# EAGLE design Word Clock (EAGLE 7.1.0)
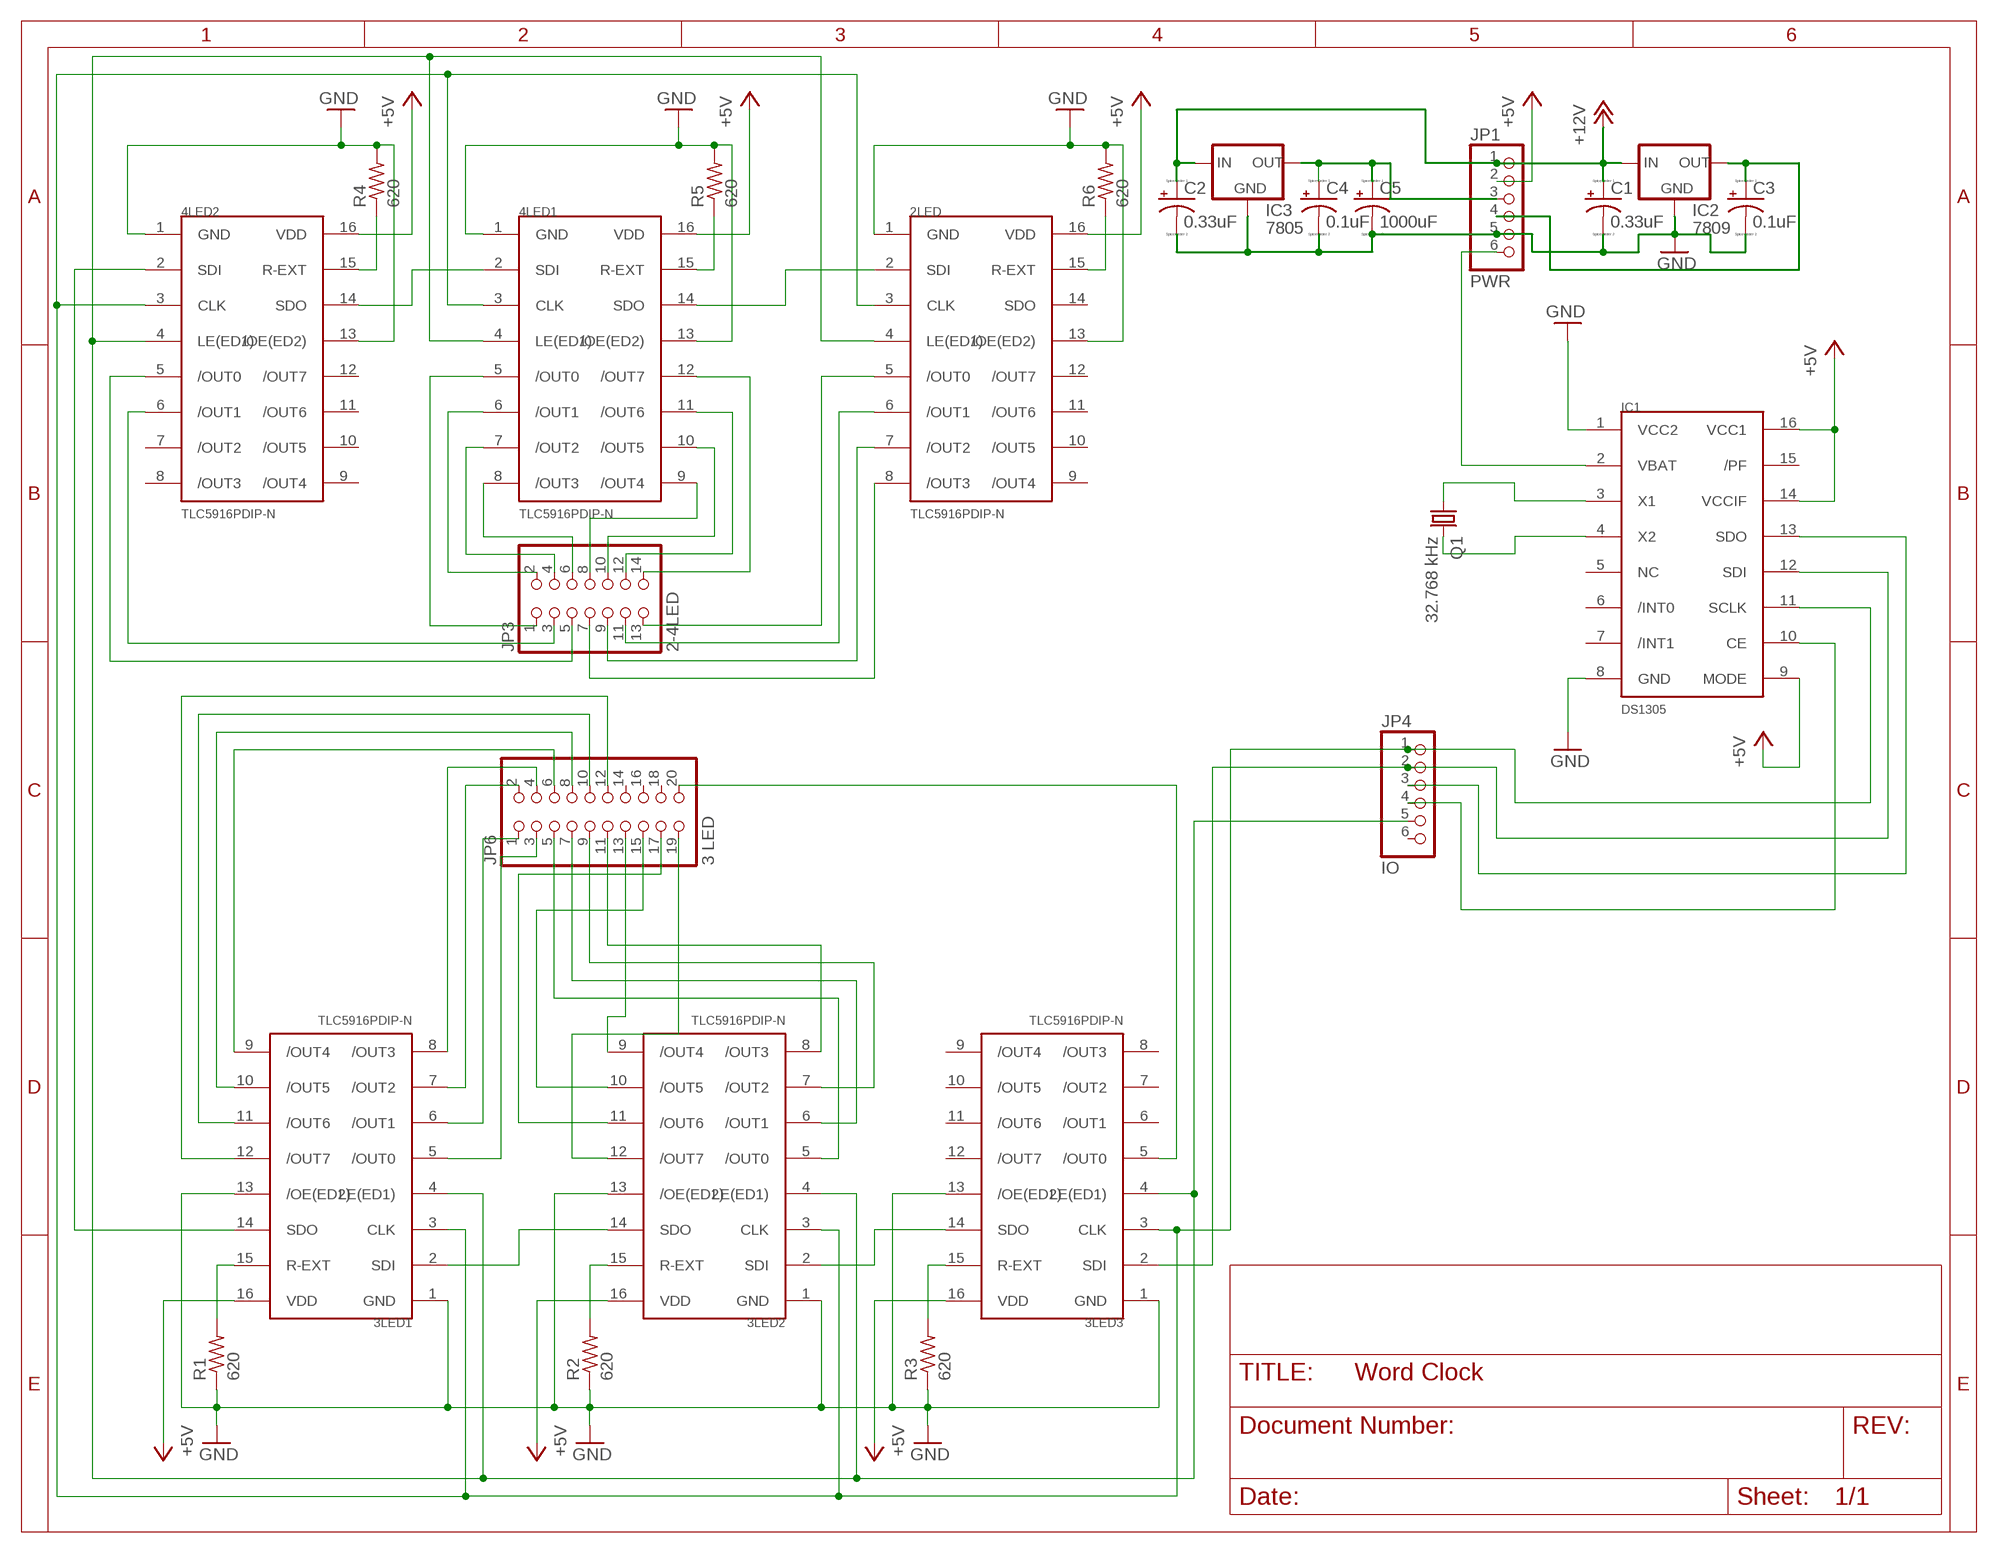
[diagram p0: schematic, sheet 1]

## Parts
2LED  TLC5916PDIP-N  [DIL16]
3LED1  TLC5916PDIP-N  [DIL16]
3LED2  TLC5916PDIP-N  [DIL16]
3LED3  TLC5916PDIP-N  [DIL16]
4LED1  TLC5916PDIP-N  [DIL16]
4LED2  TLC5916PDIP-N  [DIL16]
C1  0.33uF  CPOL-USE2-4  [E2-4]
C2  0.33uF  CPOL-USE2-4  [E2-4]
C3  0.1uF  CPOL-USE2-4  [E2-4]
C4  0.1uF  CPOL-USE2-4  [E2-4]
C5  1000uF  CPOL-USE3.5-8  [E3,5-8]
IC1  DS1305  [DIL16]
IC2  7809  78XXL  [78XXL]
IC3  7805  78XXL  [78XXL]
JP1  PWR  PINHD-1X6  [1X06]
JP3  2-4LED  PINHD-2X7  [2X07]
JP4  IO  PINHD-1X6  [1X06]
JP6  3 LED  PINHD-2X10  [2X10]
Q1  32.768 kHz  CRYSTALTC26V  [TC26V]
R1  620  R-US_V235/17  [V235/17]
R2  620  R-US_V235/17  [V235/17]
R3  620  R-US_V235/17  [V235/17]
R4  620  R-US_V235/17  [V235/17]
R5  620  R-US_V235/17  [V235/17]
R6  620  R-US_V235/17  [V235/17]

## Nets
+5V: 2LED.16(VDD) 3LED1.16(VDD) 3LED2.16(VDD) 3LED3.16(VDD) 4LED1.16(VDD) 4LED2.16(VDD) IC1.9(MODE) IC1.14(VCCIF) IC1.16(VCC1) JP1.2
+12V: C1.+ C2.+ IC2.IN IC3.IN JP1.1
GND: 2LED.1(GND) 2LED.13(/OE(ED2)) 3LED1.1(GND) 3LED1.13(/OE(ED2)) 3LED2.1(GND) 3LED2.13(/OE(ED2)) 3LED3.1(GND) 3LED3.13(/OE(ED2)) 4LED1.1(GND) 4LED1.13(/OE(ED2)) 4LED2.1(GND) 4LED2.13(/OE(ED2)) C1.- C2.- C3.- C4.- C5.- IC1.1(VCC2) IC1.8(GND) IC2.GND IC3.GND JP1.5 R1.1 R2.1 R3.1 R4.2 R5.2 R6.2
MISO: IC1.13(SDO) JP4.3
MOSI: 3LED3.2(SDI) IC1.12(SDI) JP4.2
N$1: IC1.3(X1) Q1.1
N$2: IC1.4(X2) Q1.2
N$3: 2LED.5(/OUT0) JP3.13
N$4: 2LED.6(/OUT1) JP3.11
N$5: IC1.2(VBAT) JP1.6
N$6: 2LED.7(/OUT2) JP3.9
N$7: C4.+ C5.+ IC3.OUT JP1.3
N$8: C3.+ IC2.OUT JP1.4
N$9: 2LED.8(/OUT3) JP3.7
N$10: 4LED1.12(/OUT7) JP3.14
N$11: 4LED1.11(/OUT6) JP3.12
N$12: 4LED1.10(/OUT5) JP3.10
N$13: 4LED1.9(/OUT4) JP3.8
N$14: 4LED1.8(/OUT3) JP3.6
N$15: 4LED1.7(/OUT2) JP3.4
N$16: 4LED1.6(/OUT1) JP3.2
N$17: 4LED1.5(/OUT0) JP3.1
N$18: 4LED2.6(/OUT1) JP3.3
N$19: 4LED2.5(/OUT0) JP3.5
N$20: 2LED.2(SDI) 4LED1.14(SDO)
N$21: 4LED1.2(SDI) 4LED2.14(SDO)
N$22: 3LED1.12(/OUT7) JP6.12
N$23: 3LED1.7(/OUT2) JP6.2
N$24: 3LED1.8(/OUT3) JP6.4
N$25: 3LED1.9(/OUT4) JP6.6
N$26: 4LED2.15(R-EXT) R4.1
N$27: 4LED1.15(R-EXT) R5.1
N$28: 2LED.15(R-EXT) R6.1
N$29: 3LED1.10(/OUT5) JP6.8
N$30: 3LED1.11(/OUT6) JP6.10
N$31: 3LED2.5(/OUT0) JP6.5
N$32: 3LED3.5(/OUT0) JP6.20
N$33: 3LED2.6(/OUT1) JP6.7
N$34: 3LED2.7(/OUT2) JP6.9
N$35: 2LED.4(LE(ED1)) 3LED1.4(LE(ED1)) 3LED2.4(LE(ED1)) 3LED3.4(LE(ED1)) 4LED1.4(LE(ED1)) 4LED2.4(LE(ED1)) JP4.5
N$36: 3LED1.6(/OUT1) JP6.1
N$37: 3LED1.5(/OUT0) JP6.3
N$38: 3LED2.8(/OUT3) JP6.11
N$39: 3LED2.9(/OUT4) JP6.13
N$40: 3LED2.10(/OUT5) JP6.15
N$41: 3LED2.11(/OUT6) JP6.17
N$42: 3LED2.12(/OUT7) JP6.19
N$44: 3LED2.2(SDI) 3LED3.14(SDO)
N$45: 3LED1.2(SDI) 3LED2.14(SDO)
N$46: 3LED1.14(SDO) 4LED2.2(SDI)
N$52: 3LED3.15(R-EXT) R3.2
N$53: 3LED2.15(R-EXT) R2.2
N$55: 3LED1.15(R-EXT) R1.2
SDI_CLK: 2LED.3(CLK) 3LED1.3(CLK) 3LED2.3(CLK) 3LED3.3(CLK) 4LED1.3(CLK) 4LED2.3(CLK) IC1.11(SCLK) JP4.1
SS_RTC: IC1.10(CE) JP4.4
Unconnected: 2LED.9(/OUT4) 2LED.10(/OUT5) 2LED.11(/OUT6) 2LED.12(/OUT7) 2LED.14(SDO) 3LED3.6(/OUT1) 3LED3.7(/OUT2) 3LED3.8(/OUT3) 3LED3.9(/OUT4) 3LED3.10(/OUT5) 3LED3.11(/OUT6) 3LED3.12(/OUT7) 4LED2.7(/OUT2) 4LED2.8(/OUT3) 4LED2.9(/OUT4) 4LED2.10(/OUT5) 4LED2.11(/OUT6) 4LED2.12(/OUT7) IC1.5(NC) IC1.6(/INT0) IC1.7(/INT1) IC1.15(/PF) JP4.6 JP6.14 JP6.16 JP6.18

## Library data of the parts
2LED 3LED1-3LED3 4LED1 4LED2 = TLC5916:TLC5916: TLC5916 8 Output Constant Current LED Driver. The TLC5916 is designed for LED displays and LED lighting applications with constant-current control and open-load, shorted-load, and overtemperature detection. The TLC5916 contains an 8-bit shift register and data latches, which convert serial input data into parallel output format. At the output stage, eight regulated current ports are designed to provide uniform and constant current for driving LEDs within a wide range of LED Forward Voltage (VF) variations. Used in system design for LED display applications, e.g., LED panels, it provides great flexibility and device performance. Users can adjust the output current from 3 mA to 120 mA per channel through an external resistor, Rext, which gives flexibility in controlling the light intensity of LEDs. The devices are designed for up to 20 V at the output port. The high clock frequency, 30 MHz, also satisfies the system requirements of high-volume data transmission.
C1-C5 = resistor:CPOL-US: POLARIZED CAPACITOR, American symbol
IC1 = dallas-rtc:DS1305: Serial Alarm Real-Time Clock
IC2 IC3 = v-reg:78XXL: VOLTAGE REGULATOR
JP1 JP4 = pinhead:PINHD-1X6: PIN HEADER
JP3 = pinhead:PINHD-2X7: PIN HEADER
JP6 = pinhead:PINHD-2X10: PIN HEADER
Q1 = crystal:CRYSTAL: CRYSTAL; OC_FARNELL: unknown; OC_NEWARK: unknown
R1-R6 = resistor:R-US_: RESISTOR, American symbol

## Board
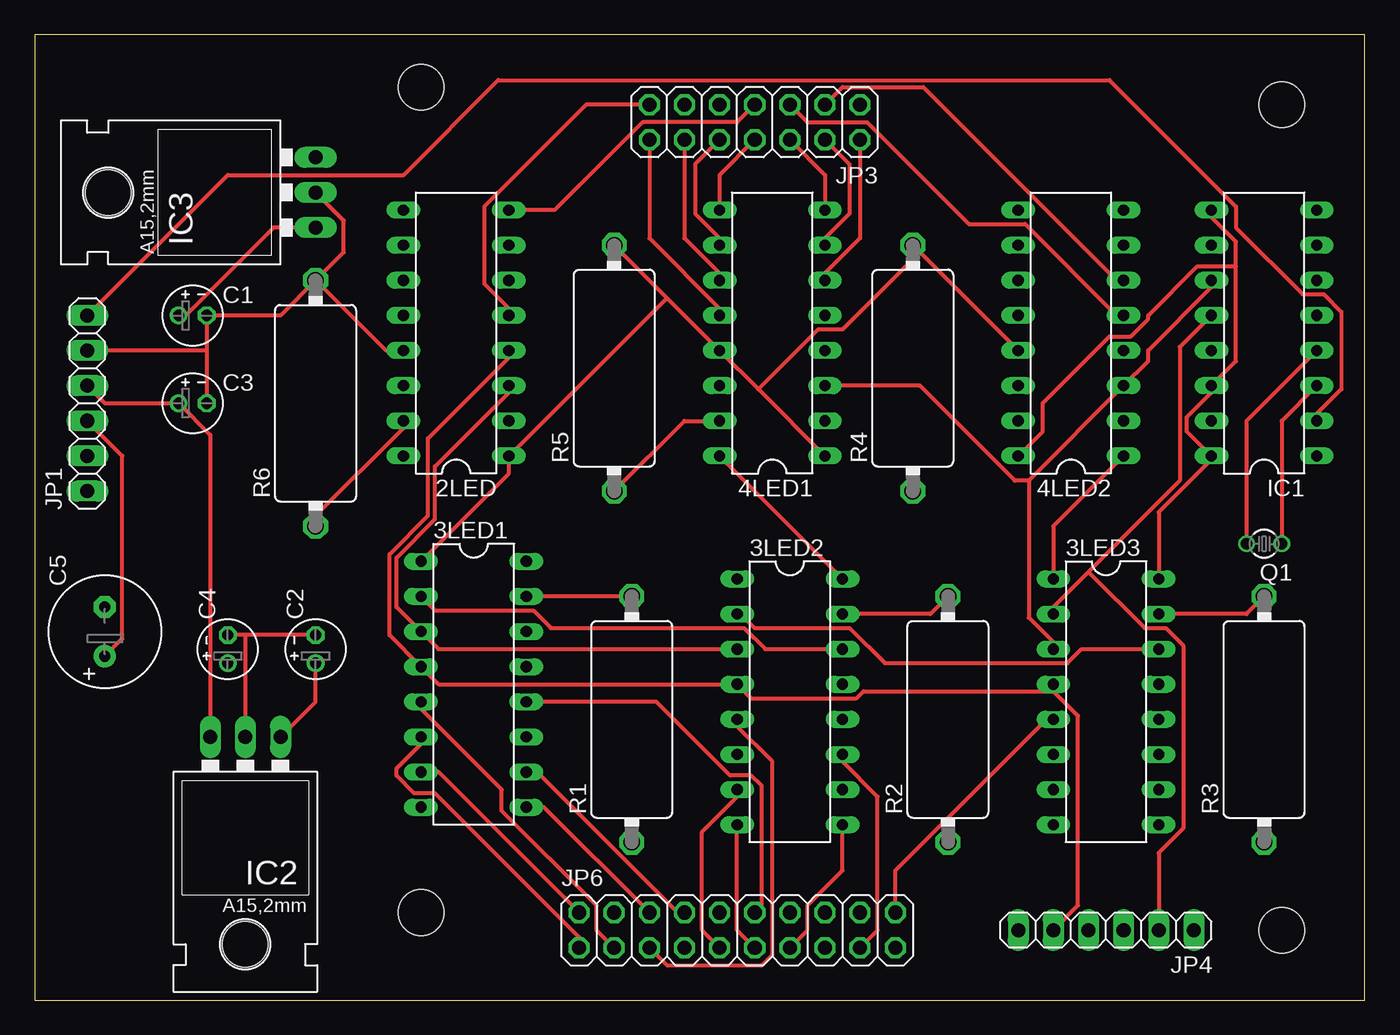
[diagram p1: board, top side]
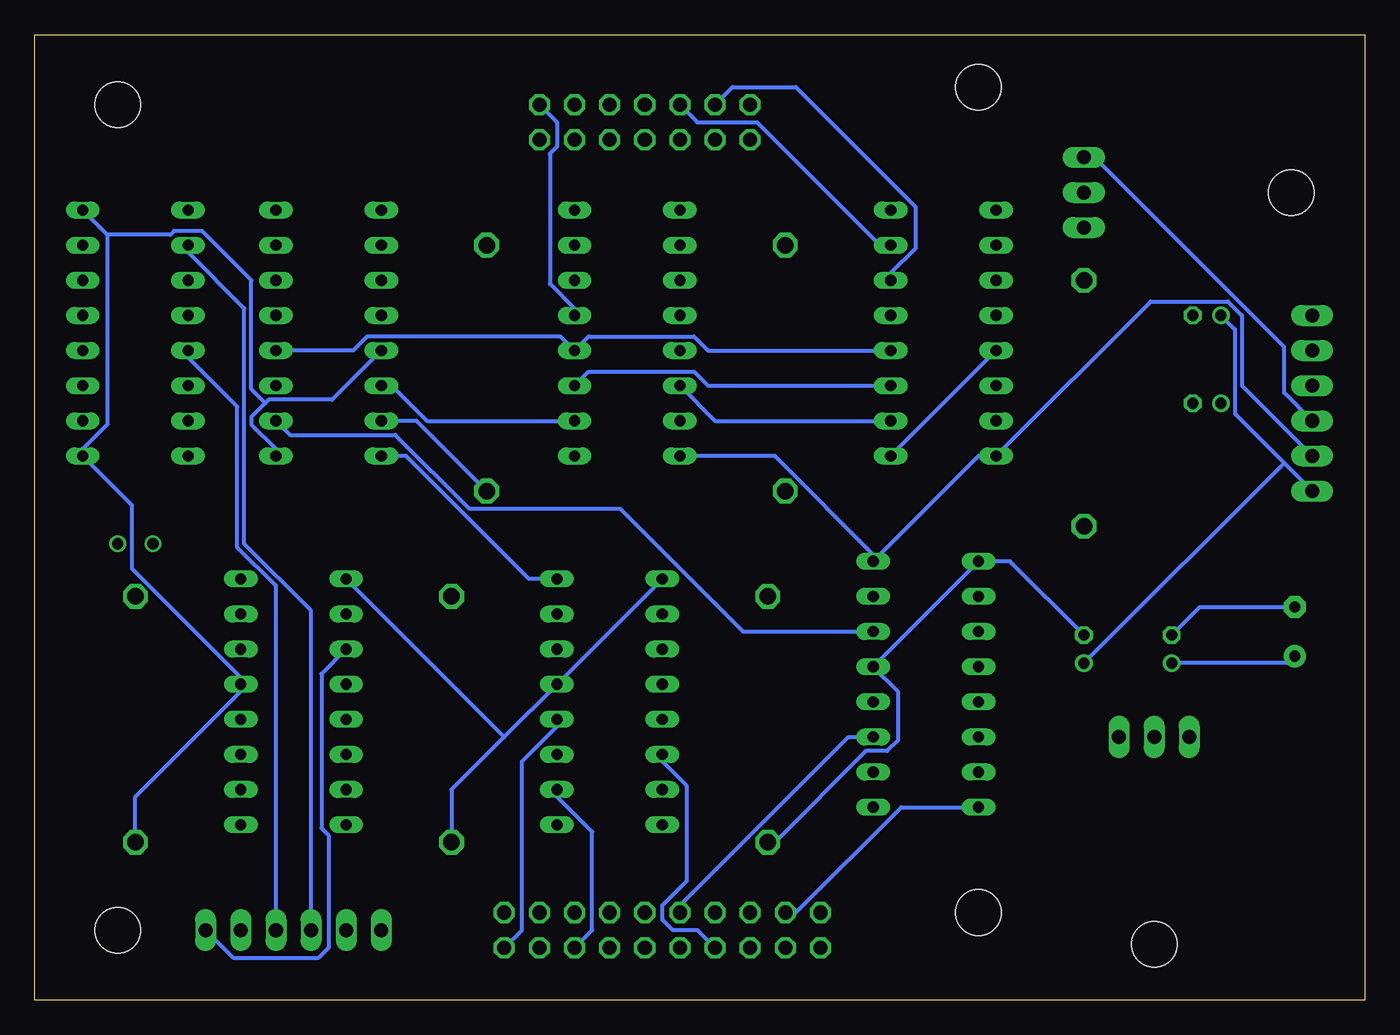
[diagram p2: board, bottom side, seen from below]

Size 96.19 x 69.84 mm. Coordinates in mm from the lower left corner, seen from the top.
Outline: 0,0 96.19,0 96.19,69.84 0,69.84 0,0
Copper layers (1*16): Top 0.0356mm / dielectric 1.5011mm / Bottom 0.0356mm
Design rules "Osh Park Design Rules LaenPCBOrder *": minimum track width 12mil, minimum drill 13mil, track to track 8mil, track to pad 8mil, pad to pad 8mil, via to via 6mil, smd to smd 6mil, copper to edge 15mil, drill to drill 6mil, minimum pad ring 7mil, minimum via ring 7mil, stop-mask expansion 3mil, vias tented up to drill 0mil, thermal gap 10mil
Holes 3.3 mm at 90.17,5.08 90.17,64.77 27.94,66.04 27.94,6.35
tRestrict: area 24.8,62.9 to 31.1,69.2; area 87,61.6 to 93.3,67.9; area 87,1.9 to 93.3,8.3; area 24.8,3.2 to 31.1,9.5

### Footprints (pad centres in the part's own frame; a part is rotated, then mirrored left to right if it is on the bottom)
DIL16 = drill 0.813 long: 1 -8.89,-3.81; 2 -6.35,-3.81; 3 -3.81,-3.81; 4 -1.27,-3.81; 5 1.27,-3.81; 6 3.81,-3.81; 7 6.35,-3.81; 8 8.89,-3.81; 9 8.89,3.81; 10 6.35,3.81; 11 3.81,3.81; 12 1.27,3.81; 13 -1.27,3.81; 14 -3.81,3.81; 15 -6.35,3.81; 16 -8.89,3.81
E2-4 = drill 0.813 pad 1.27: + -1.016,0 | drill 0.813 pad 1.27 octagon: - 1.016,0
E3,5-8 = drill 0.813 pad 1.6: + -1.778,0 | drill 0.813 pad 1.6 octagon: - 1.778,0
78XXL = drill 1.016 long: GND 0,-3.81; IN -2.54,-3.81; OUT 2.54,-3.81 | hole 3.302: 0,11.176
1X06 = drill 1.016 long: 1 -6.35,0; 2 -3.81,0; 3 -1.27,0; 4 1.27,0; 5 3.81,0; 6 6.35,0
2X07 = drill 1.016 octagon: 1 -7.62,-1.27; 2 -7.62,1.27; 3 -5.08,-1.27; 4 -5.08,1.27; 5 -2.54,-1.27; 6 -2.54,1.27; 7 0,-1.27; 8 0,1.27; 9 2.54,-1.27; 10 2.54,1.27; 11 5.08,-1.27; 12 5.08,1.27; 13 7.62,-1.27; 14 7.62,1.27
2X10 = drill 1.016 octagon: 1 -11.43,-1.27; 2 -11.43,1.27; 3 -8.89,-1.27; 4 -8.89,1.27; 5 -6.35,-1.27; 6 -6.35,1.27; 7 -3.81,-1.27; 8 -3.81,1.27; 9 -1.27,-1.27; 10 -1.27,1.27; 11 1.27,-1.27; 12 1.27,1.27; 13 3.81,-1.27; 14 3.81,1.27; 15 6.35,-1.27; 16 6.35,1.27; 17 8.89,-1.27; 18 8.89,1.27; 19 11.43,-1.27; 20 11.43,1.27
TC26V = drill 0.813: 1 -1.27,0; 2 1.27,0
V235/17 = drill 1.194 octagon: 1 -8.89,0; 2 8.89,0

### Placement (x,y rotation side)
2LED  30.48,48.26 90 top
3LED1  31.75,22.86 270 top
3LED2  54.61,21.59 270 top
3LED3  77.47,21.59 270 top
4LED1  53.34,48.26 90 top
4LED2  74.93,48.26 90 top
C1  11.43,49.53 0 top
C2  20.32,25.4 90 top
C3  11.43,43.18 0 top
C4  13.97,25.4 90 top
C5  5.08,26.67 90 top
IC1  88.9,48.26 90 top
IC2  15.24,15.24 180 top
IC3  16.51,58.42 90 top
JP1  3.81,43.18 90 top
JP3  52.07,63.5 180 top
JP4  77.47,5.08 180 top
JP6  50.8,5.08 0 top
Q1  88.9,33.02 180 top
R1  43.18,20.32 90 top
R2  66.04,20.32 90 top
R3  88.9,20.32 90 top
R4  63.5,45.72 90 top
R5  41.91,45.72 90 top
R6  20.32,43.18 90 top

### Tracks (layer width: path | path; a pad name or v marks a point on that pad's centre or on a via)
+5V
  Top 0.305: 3LED3.16 81.28,35.31 85.09,39.12 IC1.16 83.31,41.15 83.31,42.16 85.09,43.94 IC1.14 86.87,46.23 86.87,53.09 | IC1.9 85.09,56.64 86.87,54.86 86.87,53.09 | 4LED1.16 3LED2.16 | 86.87,53.09 84.07,53.09 80.52,49.53 80.52,49.28 79.25,48.01 77.72,48.01 72.9,43.18 72.9,41.15 4LED2.16
  Bottom 0.305: 4LED2.16 69.34,39.37 60.45,30.48 3LED2.16 | 35.31,32 27.94,39.37 2LED.16 15.49,50.55 9.91,50.55 8.89,49.53 8.89,44.45 JP1.2 | 4LED1.16 42.67,39.37 35.31,32 | 35.31,32 3LED1.16
+12V
  Top 0.305: C2.+ 20.32,21.59 IC2.IN | C1.+ 10.92,49.53 17.27,55.88 IC3.IN
  Bottom 0.305: 5.84,38.86 9.4,42.42 9.4,48.51 C1.+ | 5.84,38.86 JP1.1 | 5.84,38.86 C2.+
GND
  Top 0.305: 12.45,46.99 C1.- 17.78,49.53 R6.2 | 12.45,46.99 C3.- | 12.45,46.99 JP1.5 | 2LED.13 25.4,46.99 R6.2 | IC3.GND 22.35,56.39 22.35,54.1 R6.2 | 3LED1.1 34.29,38.1 2LED.1 45.72,50.8 | C2.- 15.24,26.42 | 15.24,26.42 C4.- | 15.24,26.42 IC2.GND | R5.2 45.72,50.8 | 45.72,50.8 4LED1.13 52.32,44.2 | 52.32,44.2 4LED1.1 | 3LED3.1 73.66,34.29 4LED2.1 | 64.01,54.1 4LED2.13 | 52.32,44.2 56.64,48.51 58.42,48.51 64.01,54.1 | 64.01,54.1 R4.2
  Bottom 0.305: C2.- 25.65,31.75 3LED1.1 3LED1.13 33.78,22.35 33.78,18.8 34.54,18.03 36.07,18.03 42.67,11.43 R1.1 | C5.- 11.94,28.45 C4.- | 2LED.1 2LED.13 | 3LED2.1 3LED2.13 62.23,19.05 | R2.1 66.04,15.24 62.23,19.05 | R3.1 88.9,14.73 81.28,22.35 3LED3.13 81.28,23.37 89.15,31.24 89.15,35.81 IC1.1 92.71,39.88 90.93,41.66 90.93,55.37 | IC1.8 90.93,55.37 | 4LED2.1 78.74,39.88 80.52,41.66 80.52,42.16 79.5,43.18 | 79.5,43.18 79.25,43.43 74.68,43.43 4LED2.13 | 90.93,55.37 86.36,55.37 86.11,55.63 84.07,55.63 80.52,52.07 80.52,44.2 79.5,43.18 | 3LED3.1 62.23,19.05
MISO
  Bottom 0.305: IC1.13 85.09,46.48 81.53,42.93 81.53,32.77 78.74,29.97 JP4.3
MOSI
  Top 0.305: 3LED3.2 73.66,28.45 76.2,30.99 | 76.2,30.99 82.8,37.59 82.8,47.24 IC1.12 | JP4.2 81.28,10.67 83.06,12.45 83.06,25.65 81.79,26.92 80.26,26.92 76.2,30.99
N$1
  Top 0.305: Q1.1 90.17,41.91 IC1.3
N$2
  Top 0.305: Q1.2 87.63,41.91 IC1.4
N$3
  Top 0.305: 2LED.5 34.29,50.04 32.51,51.82 32.51,57.4 39.88,64.77 JP3.13
N$4
  Bottom 0.305: 2LED.6 34.29,52.58 32.51,54.36 32.51,57.4 41.15,66.04 45.72,66.04 JP3.11
N$5
  Top 0.305: IC1.2 92.71,42.42 94.49,44.2 94.49,49.78 93.22,51.05 91.69,51.05 86.87,55.88 86.87,57.4 77.72,66.55 33.53,66.55 26.67,59.69 13.97,59.69 JP1.6
N$6
  Bottom 0.305: 2LED.7 35.05,54.61 43.94,63.5 48.26,63.5 JP3.9
N$7
  Top 0.305: JP1.3 6.35,39.37 6.35,26.16 C5.+
  Bottom 0.305: C4.+ 5.59,24.38 C5.+ | IC3.OUT 19.56,60.96 5.84,47.24 5.84,43.94 JP1.3
N$8
  Top 0.305: JP1.4 5.08,43.18 C3.+ 12.7,40.89 IC2.OUT
N$9
  Top 0.305: 2LED.8 37.59,57.15 43.94,63.5 50.8,63.5 JP3.7
N$10
  Top 0.305: 4LED1.12 49.53,50.04 44.45,55.12 JP3.14
N$11
  Top 0.305: 4LED1.11 49.53,52.58 46.99,55.12 JP3.12
N$12
  Top 0.305: 4LED1.10 49.53,55.12 47.75,56.9 47.75,60.45 JP3.10
N$13
  Top 0.305: 4LED1.9 49.53,59.69 JP3.8
N$14
  Top 0.305: 4LED1.8 57.15,59.69 JP3.6
N$15
  Top 0.305: 4LED1.7 57.15,55.12 58.93,56.9 58.93,60.45 JP3.4
N$16
  Top 0.305: 4LED1.6 57.15,52.58 59.69,55.12 JP3.2
N$17
  Bottom 0.305: 4LED1.5 57.15,50.04 58.93,51.82 58.93,61.21 58.42,61.72 58.42,63.5 JP3.1
N$18
  Top 0.305: 4LED2.6 78.23,52.07 64.26,66.04 58.42,66.04 JP3.3
N$19
  Top 0.305: 4LED2.5 78.23,49.53 71.63,56.13 67.56,56.13 60.2,63.5 55.88,63.5 JP3.5
N$20
  Bottom 0.305: 2LED.2 46.99,41.91 4LED1.14
N$21
  Bottom 0.305: 4LED1.2 67.82,41.91 70.36,44.45 4LED2.14
N$22
  Top 0.305: 3LED1.12 44.96,21.59 50.29,16.26 51.82,16.26 52.58,15.49 52.58,6.86 JP6.12
N$23
  Top 0.305: 3LED1.7 29.21,16.51 JP6.2
N$24
  Bottom 0.305: 3LED1.8 33.53,13.97 41.15,6.35 JP6.4
N$25
  Top 0.305: 3LED1.9 36.83,13.97 JP6.6
N$26
  Bottom 0.305: 4LED2.15 68.58,41.91 R4.1
N$27
  Top 0.305: 4LED1.15 46.99,41.91 R5.1
N$28
  Top 0.305: 2LED.15 26.67,41.4 20.32,35.05 R6.1
N$29
  Top 0.305: 3LED1.10 36.32,16.51 46.48,6.35 JP6.8
N$30
  Bottom 0.305: 3LED1.11 37.34,19.05 49.53,6.86 JP6.10
N$31
  Top 0.305: 3LED2.5 50.8,19.81 53.34,17.27 53.34,3.3 52.58,2.54 45.72,2.54 JP6.5
N$32
  Top 0.305: 3LED3.5 73.15,20.32 62.23,9.4 JP6.20
N$33
  Bottom 0.305: 3LED2.6 50.8,17.27 49.02,15.49 49.02,8.64 50.8,6.86 50.8,5.84 50.04,5.08 48.26,5.08 JP6.7
N$34
  Top 0.305: 3LED2.7 50.8,14.73 48.26,12.19 48.26,5.08 JP6.9
N$35
  Top 0.305: 73.66,22.35 75.44,20.57 75.44,6.86 JP4.5 | 73.66,22.35 59.94,22.35 59.44,21.84 51.82,21.84 3LED2.4 29.21,22.86 3LED1.4 25.65,26.42 25.65,32.26 28.45,35.05 28.45,40.64 34.29,46.48 2LED.4 | 73.66,22.35 3LED3.4
  Bottom 0.305: 2LED.4 47.5,46.99 48.51,48.01 56.13,48.01 4LED1.4 58.17,48.01 72.14,48.01 73.15,46.99 4LED2.4
N$36
  Top 0.305: 3LED1.6 27.94,18.54 26.16,16.76 26.16,16.26 27.43,14.99 28.96,14.99 39.37,4.57 JP6.1
N$37
  Top 0.305: 3LED1.5 27.94,21.08 33.78,15.24 33.78,13.72 40.64,6.86 40.64,5.08 JP6.3
N$38
  Top 0.305: 3LED2.8 50.8,5.08 JP6.11
N$39
  Top 0.305: 3LED2.9 58.42,9.4 55.88,6.86 55.88,5.08 JP6.13
N$40
  Bottom 0.305: 3LED2.10 58.42,14.73 55.88,12.19 55.88,5.08 JP6.15
N$41
  Top 0.305: 3LED2.11 58.42,17.27 60.96,14.73 60.96,5.08 JP6.17
N$42
  Bottom 0.305: 3LED2.12 58.42,19.81 60.96,17.27 60.96,5.08 JP6.19
N$44
  Top 0.305: 3LED3.14 75.69,25.4 74.68,24.38 61.47,24.38 58.93,26.92 52.07,26.92 51.05,27.94 3LED2.2
N$45
  Top 0.305: 3LED2.14 52.83,25.4 51.31,26.92 37.34,26.92 36.07,28.19 28.96,28.19 3LED1.2
N$46
  Bottom 0.305: 3LED1.14 44.96,26.67 53.85,35.56 64.77,35.56 70.1,40.89 77.72,40.89 4LED2.2
N$52
  Top 0.305: 3LED3.15 87.63,27.94 R3.2
N$53
  Top 0.305: 3LED2.15 64.77,27.94 R2.2
N$55
  Top 0.305: R1.2 3LED1.15
SDI_CLK
  Top 0.305: 3LED2.3 29.21,25.4 3LED1.3 26.16,28.45 26.16,32 28.96,34.8 28.96,38.61 34.29,43.94 2LED.3 | 3LED3.3 73.66,25.91 71.88,27.69 71.88,37.59 | 71.88,37.59 4LED2.3 80.52,46.23 80.52,46.99 85.09,51.56 IC1.11 | 4LED1.3 64.01,44.45 70.87,37.59 71.88,37.59
  Bottom 0.305: JP4.1 81.79,3.05 75.69,3.05 74.93,3.81 74.93,11.94 75.44,12.45 75.44,23.62 3LED3.3 | 2LED.3 47.5,44.45 48.51,45.47 56.13,45.47 4LED1.3
SS_RTC
  Bottom 0.305: IC1.10 85.09,54.1 81.03,50.04 81.03,33.02 76.2,28.19 JP4.4